# EAGLE design M611B (EAGLE 6.6.0)
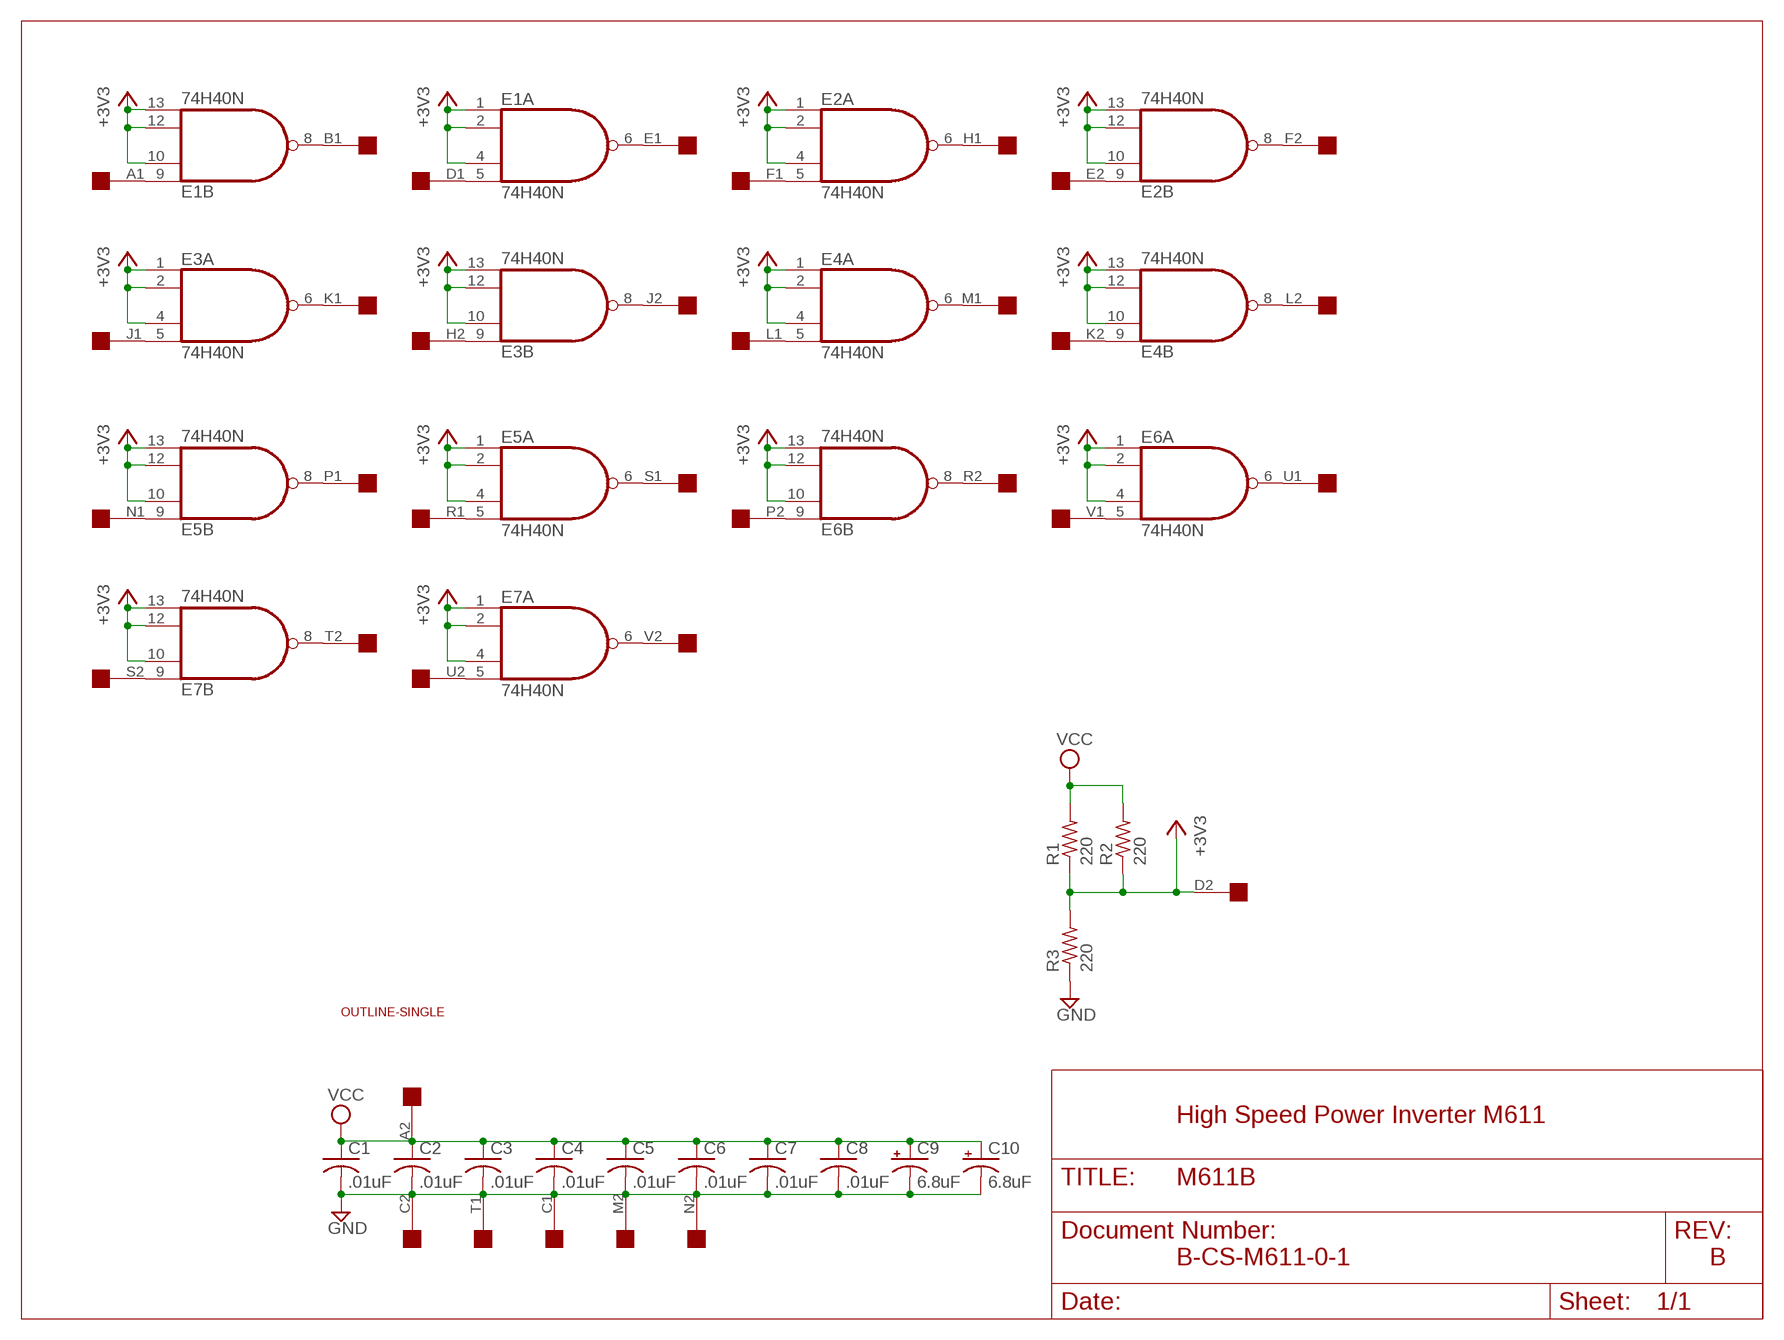
[diagram p0: schematic, sheet 1]

## Parts
C1  .01uF  C-US050-025X075  [C050-025X075]
C2  .01uF  C-US050-025X075  [C050-025X075]
C3  .01uF  C-US050-025X075  [C050-025X075]
C4  .01uF  C-US050-025X075  [C050-025X075]
C5  .01uF  C-US050-025X075  [C050-025X075]
C6  .01uF  C-US050-025X075  [C050-025X075]
C7  .01uF  C-US050-025X075  [C050-025X075]
C8  .01uF  C-US050-025X075  [C050-025X075]
C9  6.8uF  CPOL-USE20-8AXIAL  [E12-8]
C10  6.8uF  CPOL-USE20-8AXIAL  [E12-8]
E1  74H40N  74S20N  [DIL14]
E2  74H40N  74S20N  [DIL14]
E3  74H40N  74S20N  [DIL14]
E4  74H40N  74S20N  [DIL14]
E5  74H40N  74S20N  [DIL14]
E6  74H40N  74S20N  [DIL14]
E7  74H40N  74S20N  [DIL14]
R1  220  R-US_0207/10  [0207/10]
R2  220  R-US_0207/10  [0207/10]
R3  220  R-US_0207/10  [0207/10]
U$1  SINGLE  [EDGE-CON2]
U$4  OUTLINE-SINGLE  [SINGLE]

## Nets
+3V3 [Supply]: E1.1(A:I0) E1.2(A:I1) E1.4(A:I2) E1.10(B:I1) E1.12(B:I2) E1.13(B:I3) E2.1(A:I0) E2.2(A:I1) E2.4(A:I2) E2.10(B:I1) E2.12(B:I2) E2.13(B:I3) E3.1(A:I0) E3.2(A:I1) E3.4(A:I2) E3.10(B:I1) E3.12(B:I2) E3.13(B:I3) E4.1(A:I0) E4.2(A:I1) E4.4(A:I2) E4.10(B:I1) E4.12(B:I2) E4.13(B:I3) E5.1(A:I0) E5.2(A:I1) E5.4(A:I2) E5.10(B:I1) E5.12(B:I2) E5.13(B:I3) E6.1(A:I0) E6.2(A:I1) E6.4(A:I2) E6.10(B:I1) E6.12(B:I2) E6.13(B:I3) E7.1(A:I0) E7.2(A:I1) E7.4(A:I2) E7.10(B:I1) E7.12(B:I2) E7.13(B:I3) R1.1 R2.1 R3.2 U$1.D2
GND [Supply]: C1.2 C2.2 C3.2 C4.2 C5.2 C6.2 C7.2 C8.2 C9.- C10.- R3.1 U$1.C1 U$1.C2 U$1.M2 U$1.N2 U$1.T1
N$1: E1.9(B:I0) U$1.A1
N$2: E1.8(B:O) U$1.B1
N$3: E1.5(A:I3) U$1.D1
N$4: E1.6(A:O) U$1.E1
N$5: E2.6(A:O) U$1.H1
N$6: E2.5(A:I3) U$1.F1
N$7: E3.5(A:I3) U$1.J1
N$8: E3.6(A:O) U$1.K1
N$9: E2.9(B:I0) U$1.E2
N$10: E2.8(B:O) U$1.F2
N$11: E3.9(B:I0) U$1.H2
N$12: E3.8(B:O) U$1.J2
N$13: E4.5(A:I3) U$1.L1
N$14: E4.6(A:O) U$1.M1
N$15: E4.9(B:I0) U$1.K2
N$16: E4.8(B:O) U$1.L2
N$17: E5.9(B:I0) U$1.N1
N$18: E5.8(B:O) U$1.P1
N$19: E5.5(A:I3) U$1.R1
N$20: E5.6(A:O) U$1.S1
N$21: E6.9(B:I0) U$1.P2
N$22: E6.8(B:O) U$1.R2
N$23: E6.5(A:I3) U$1.V1
N$24: E6.6(A:O) U$1.U1
N$25: E7.9(B:I0) U$1.S2
N$26: E7.8(B:O) U$1.T2
N$27: E7.5(A:I3) U$1.U2
N$28: E7.6(A:O) U$1.V2
VCC [Supply]: C1.1 C2.1 C3.1 C4.1 C5.1 C6.1 C7.1 C8.1 C9.+ C10.+ R1.2 R2.2 U$1.A2
Unconnected: U$1.B2

## Notes on the sheet
- High Speed Power Inverter M611
- B-CS-M611-0-1 | B

## Power pins joined to a net without a drawn wire
GND: E1.7(P:GND) E2.7(P:GND) E3.7(P:GND) E4.7(P:GND) E5.7(P:GND) E6.7(P:GND) E7.7(P:GND)
VCC: E1.14(P:VCC) E2.14(P:VCC) E3.14(P:VCC) E4.14(P:VCC) E5.14(P:VCC) E6.14(P:VCC) E7.14(P:VCC)

## Library data of the parts
C1-C8 = rcl:C-US: CAPACITOR, American symbol
C9 C10 = dec-con:CPOL-USE20-8AXIAL: A 0.8 inch electrolytic.
E1-E7 = 74xx-us:74*20: Dual 4-input NAND gate
R1-R3 = rcl:R-US_: RESISTOR, American symbol
U$1 = dec-con:SINGLE: Single-Height DEC board
U$4 = dec-con:OUTLINE-*: Board outlines for DEC boards.

## Net classes
1 Supply: width 0.813 mm

## Board
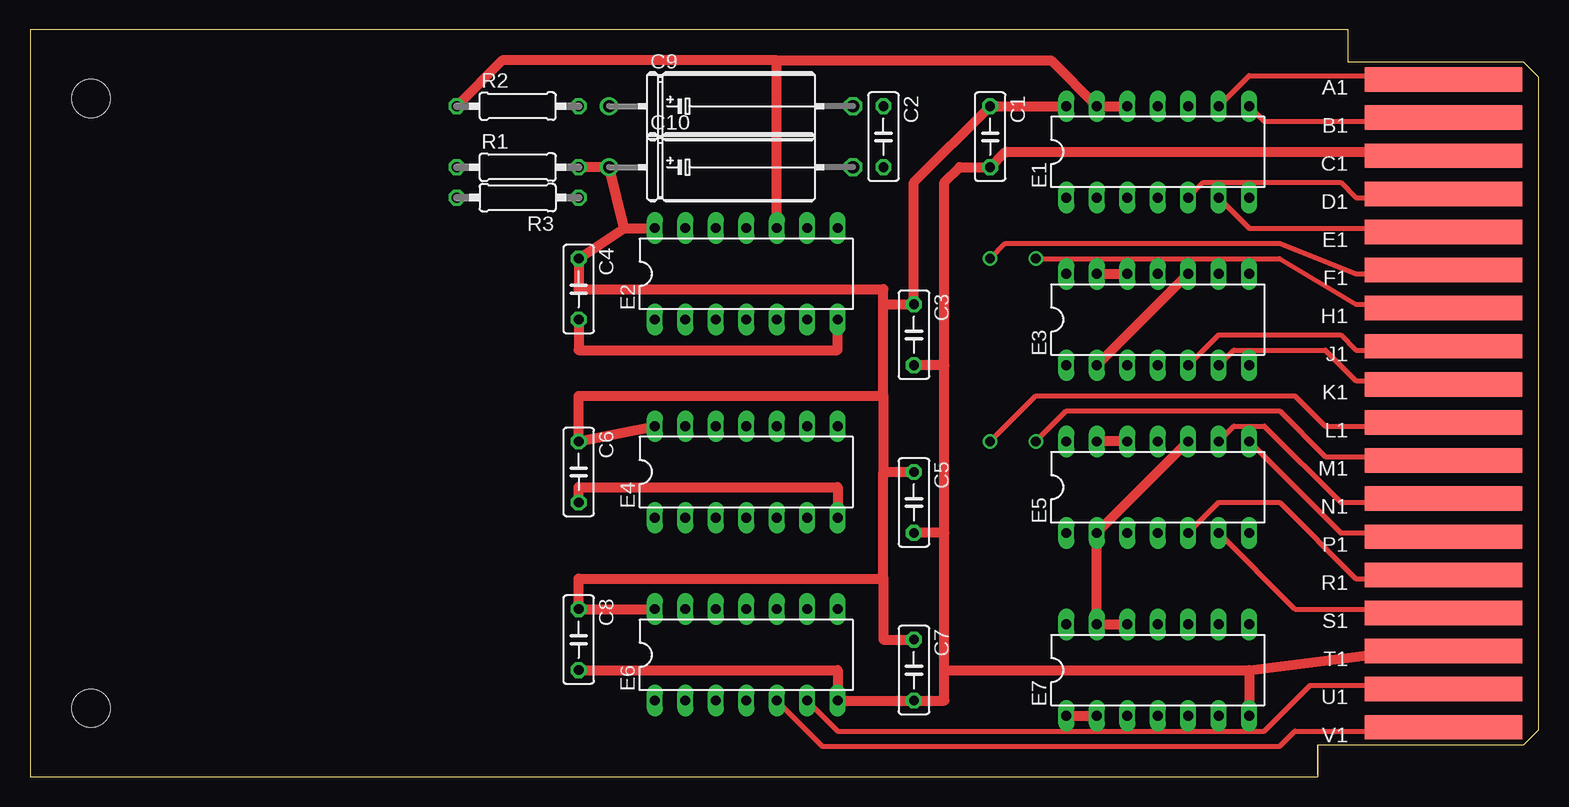
[diagram p1: board, top side]
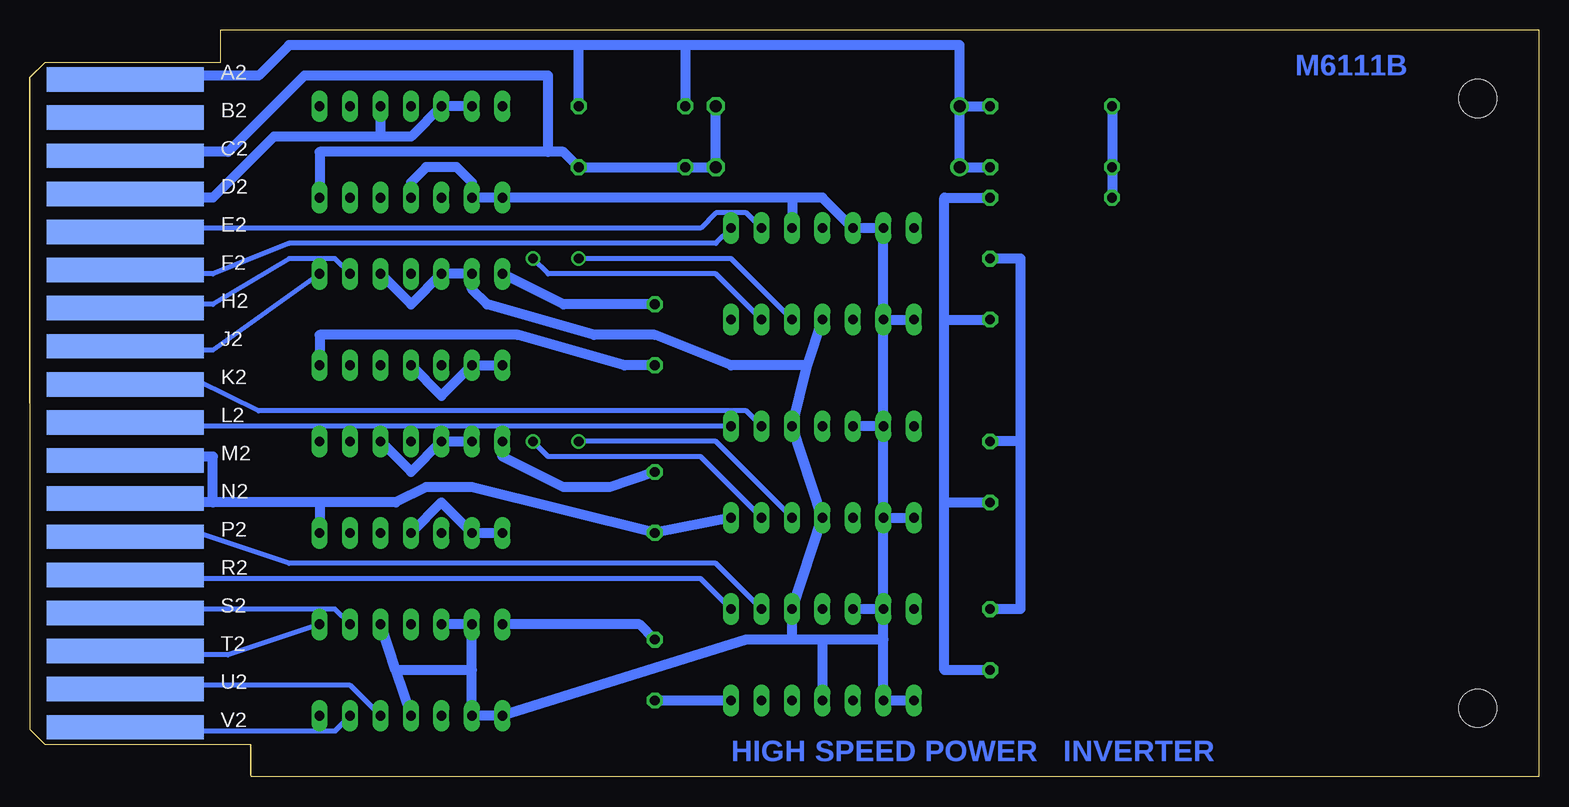
[diagram p2: board, bottom side, seen from below]

Size 125.73 x 62.23 mm. Coordinates in mm from the lower left corner, seen from the top.
Copper layers (1+16): Top 0.035mm / dielectric 1.5mm / Bottom 0.035mm
Design rules "16mils": minimum track width 16mil, minimum drill 32mil, track to track 15mil, track to pad 10mil, pad to pad 10mil, via to via 10mil, smd to smd 10mil, copper to edge 13mil, drill to drill 10mil, minimum pad ring 10mil, minimum via ring 8mil, stop-mask expansion 0mil, vias tented up to drill 0mil, thermal gap 10mil

### Footprints (pad centres in the part's own frame; a part is rotated, then mirrored left to right if it is on the bottom)
C050-025X075 = drill 0.813 octagon: 1 -2.54,0; 2 2.54,0
E12-8 = drill 1.016: + -10.16,0 | drill 1.016 octagon: - 10.16,0
DIL14 = drill 0.813 long: 1 -7.62,-3.81; 2 -5.08,-3.81; 3 -2.54,-3.81; 4 0,-3.81; 5 2.54,-3.81; 6 5.08,-3.81; 7 7.62,-3.81; 8 7.62,3.81; 9 5.08,3.81; 10 2.54,3.81; 11 0,3.81; 12 -2.54,3.81; 13 -5.08,3.81; 14 -7.62,3.81
0207/10 = drill 0.813 octagon: 1 -5.08,0; 2 5.08,0
EDGE-CON2 = smd 13.106 x 2.032: A1 7.938,4.128; B1 7.938,7.303; C1 7.938,10.477; D1 7.938,13.652; E1 7.938,16.828; F1 7.938,20.003; H1 7.938,23.177; J1 7.938,26.352; K1 7.938,29.527; L1 7.938,32.703; M1 7.938,35.877; N1 7.938,39.053; P1 7.938,42.227; R1 7.938,45.403; S1 7.938,48.578; T1 7.938,51.752; U1 7.938,54.928; V1 7.938,58.102 | smd 13.106 x 2.032 bottom: A2 7.938,4.128; B2 7.938,7.303; C2 7.938,10.477; D2 7.938,13.652; E2 7.938,16.828; F2 7.938,20.003; H2 7.938,23.177; J2 7.938,26.352; K2 7.938,29.527; L2 7.938,32.703; M2 7.938,35.877; N2 7.938,39.053; P2 7.938,42.227; R2 7.938,45.403; S2 7.938,48.578; T2 7.938,51.752; U2 7.938,54.928; V2 7.938,58.102
SINGLE = hole 3.175: 120.65,56.515; 120.65,5.715

### Placement (x,y rotation side)
C1  80.01,53.34 270 top
C2  71.12,53.34 270 top
C3  73.66,36.83 270 top
C4  45.72,40.64 270 top
C5  73.66,22.86 270 top
C6  45.72,25.4 270 top
C7  73.66,8.89 270 top
C8  45.72,11.43 270 top
C9  58.42,55.88 0 top
C10  58.42,50.8 0 top
E1  93.98,52.07 0 top
E2  59.69,41.91 0 top
E3  93.98,38.1 0 top
E4  59.69,25.4 0 top
E5  93.98,24.13 0 top
E6  59.69,10.16 0 top
E7  93.98,8.89 0 top
R1  40.64,50.8 0 top
R2  40.64,55.88 0 top
R3  40.64,48.26 180 top
U$1  125.73,62.23 180 top
U$4  125.73,62.23 180 top

### Tracks (layer width: path | path; a pad name or v marks a point on that pad's centre or on a via)
+3V3
  Top 0.813: E1.12 E1.13 85.09,59.69 62.23,59.69 | 62.23,59.69 39.37,59.69 R2.1 | E2.10 62.23,59.69 | E3.13 E3.12 | E5.12 E5.13 | E7.12 E7.13 E5.2 E5.10 | E7.1 E7.2 | E3.10 E3.2
  Bottom 0.813: E5.13 E5.12 93.98,25.4 E5.10 | E7.12 E7.13 88.9,8.89 | 54.61,11.43 59.69,11.43 | 59.69,11.43 62.23,11.43 | 62.23,48.26 59.69,48.26 E2.12 E2.13 E2.2 | R2.1 R1.1 R3.2 | E1.4 93.98,49.53 92.71,50.8 90.17,50.8 88.9,49.53 E1.2 E1.1 62.23,48.26 | E1.13 E1.12 93.98,53.34 96.52,53.34 | U$1.D2 117.14,48.56 116.84,48.26 110.49,48.26 105.41,53.34 96.52,53.34 | 96.52,53.34 E1.10 | 62.23,48.26 E2.10 | E2.2 E2.1 | E5.1 E5.2 91.44,22.86 E5.4 | E6.1 E6.2 54.61,11.43 | 54.61,11.43 E6.13 | E4.2 E4.1 | E6.13 E4.2 | E6.13 E6.12 | E4.13 E4.12 | E4.2 E4.13 | E4.13 E2.2 | 59.69,11.43 E6.4 | 62.23,11.43 E6.10 E4.4 E4.10 60.96,34.29 | 60.96,34.29 E2.4 | 62.23,11.43 66.04,11.43 E7.1 E7.2 88.9,8.89 | 95.25,8.89 E7.4 | 95.25,8.89 E7.10 | 88.9,8.89 95.25,8.89 | E3.1 E3.2 91.44,31.75 E3.4 | E3.10 93.98,39.37 E3.12 E3.13 88.9,40.64 87.63,39.37 78.74,36.83 73.66,36.83 67.31,34.29 60.96,34.29
GND
  Top 0.813: 116.84,52.07 U$1.C1 117.17,51.74 116.84,52.07 | 116.84,52.07 81.28,52.07 C1.2 77.47,50.8 76.2,49.53 76.2,34.29 | C4.2 45.72,35.56 67.31,35.56 E2.7 | 76.2,8.89 76.2,6.35 C7.2 E6.7 67.31,8.89 C8.2 | 76.2,8.89 76.2,20.32 | 76.2,20.32 C5.2 | 76.2,34.29 C3.2 | 76.2,20.32 76.2,34.29 | C6.2 45.72,24.13 67.31,24.13 E4.7 | 101.6,8.89 111.76,10.16 U$1.T1 | 101.6,8.89 E7.7 | 76.2,8.89 101.6,8.89
  Bottom 0.813: R3.1 49.53,48.26 49.53,38.1 | 49.53,38.1 C4.2 | C8.2 49.53,8.89 49.53,22.86 | 49.53,22.86 49.53,38.1 | 49.53,22.86 C6.2 | C9.- C10.- C2.2 C1.2 81.28,52.07 82.55,52.07 | 82.55,52.07 101.6,52.07 E1.7 | U$1.C1 115.9,51.74 115.57,52.07 109.22,52.07 102.87,58.42 82.55,58.42 82.55,52.07 | E6.7 C7.2 | E4.7 C5.2 88.9,24.13 92.71,24.13 95.25,22.86 101.6,22.86 | U$1.N2 116.84,22.86 110.49,22.86 | 101.6,22.86 110.49,22.86 | U$1.M2 116.84,26.67 110.49,26.67 110.49,22.86 | 101.6,22.86 E5.7 | E3.7 101.6,36.83 85.09,36.83 76.2,34.29 C3.2
N$1
  Top 0.406: U$1.A1 117.24,58.02 116.84,58.42 101.6,58.42 E1.9
N$2
  Top 0.406: U$1.B1 117.13,54.9 116.84,54.61 102.87,54.61 E1.8
N$3
  Top 0.406: U$1.D1 116.84,48.26 110.49,48.26 109.22,49.53 97.79,49.53 E1.5
N$4
  Top 0.406: U$1.E1 116.84,45.72 101.6,45.72 E1.6
N$5  (via drill 0.81)
  Top 0.406: v83.82,43.18 104.14,43.18 110.49,39.37 116.84,39.37 U$1.H1
  Bottom 0.406: E2.6 68.58,41.91 82.55,41.91 v83.82,43.18
N$6  (via drill 0.81)
  Top 0.406: v80.01,43.18 81.28,44.45 104.14,44.45 110.49,41.91 116.84,41.91 U$1.F1
  Bottom 0.406: E2.5 67.31,43.18 v80.01,43.18
N$7
  Top 0.406: E3.5 99.06,36.83 109.22,36.83 110.49,35.56 116.84,35.56 U$1.J1
N$8
  Top 0.406: U$1.K1 116.84,33.02 110.49,33.02 107.95,35.56 100.33,35.56 E3.6
N$9
  Bottom 0.406: E2.9 66.04,46.99 68.58,46.99 69.85,45.72 116.84,45.72 U$1.E2
N$10
  Bottom 0.406: E2.8 68.58,44.45 104.14,44.45 110.49,41.91 116.84,41.91 U$1.F2
N$11
  Bottom 0.406: U$1.H2 116.84,39.37 110.49,39.37 104.14,43.18 100.33,43.18 E3.9
N$12
  Bottom 0.406: U$1.J2 116.84,35.56 110.49,35.56 E3.8
N$13  (via drill 0.81)
  Top 0.406: v80.01,27.94 83.82,31.75 105.41,31.75 107.95,29.21 116.84,29.21 U$1.L1
  Bottom 0.406: E4.5 68.58,27.94 v80.01,27.94
N$14  (via drill 0.81)
  Top 0.406: U$1.M1 116.84,26.67 107.95,26.67 104.14,30.48 86.36,30.48 v83.82,27.94
  Bottom 0.406: E4.6 69.85,26.67 82.55,26.67 v83.82,27.94
N$15
  Bottom 0.406: U$1.K2 116.84,33.02 111.76,33.02 106.68,30.48 66.04,30.48 E4.9
N$16
  Bottom 0.406: U$1.L2 116.84,29.21 E4.8
N$17
  Top 0.406: E5.9 100.33,29.21 102.87,29.21 109.22,22.86 116.84,22.86 U$1.N1
N$18
  Top 0.406: U$1.P1 116.84,20.32 109.22,20.32 E5.8
N$19
  Top 0.406: E5.5 99.06,22.86 104.14,22.86 110.49,16.51 116.84,16.51 U$1.R1
N$20
  Top 0.406: U$1.S1 116.84,13.97 105.41,13.97 E5.6
N$21
  Bottom 0.406: E6.9 68.58,17.78 104.14,17.78 111.76,20.32 116.84,20.32 U$1.P2
N$22
  Bottom 0.406: U$1.R2 116.84,16.51 69.85,16.51 E6.8
N$23
  Top 0.406: E6.5 66.04,2.54 104.14,2.54 105.41,3.81 116.84,3.81 U$1.V1
N$24
  Top 0.406: E6.6 67.31,3.81 102.87,3.81 106.68,7.62 116.84,7.62 U$1.U1
N$25
  Bottom 0.406: U$1.S2 116.84,13.97 100.33,13.97 E7.9
N$26
  Bottom 0.406: U$1.T2 116.84,10.16 109.22,10.16 E7.8
N$27
  Bottom 0.406: U$1.U2 116.84,7.62 99.06,7.62 E7.5
N$28
  Bottom 0.406: U$1.V2 116.84,3.81 100.33,3.81 E7.6
VCC
  Top 0.813: E1.14 C1.1 73.66,49.53 C3.1 71.12,39.37 | 49.53,45.72 C4.1 45.72,40.64 71.12,40.64 71.12,39.37 | 49.53,45.72 E2.14 | R1.2 C10.+ 49.53,45.72 | E6.14 C8.1 45.72,16.51 71.12,16.51 | E4.14 C6.1 45.72,31.75 71.12,31.75 | C7.1 71.12,11.43 71.12,16.51 | 71.12,16.51 71.12,25.4 | 71.12,25.4 C5.1 | 71.12,31.75 71.12,25.4 | 71.12,31.75 71.12,39.37
  Bottom 0.813: U$1.A2 116.84,58.42 106.68,58.42 104.14,60.96 80.01,60.96 | C1.1 80.01,60.96 | 71.12,60.96 C2.1 | 71.12,60.96 80.01,60.96 | C9.+ C10.+ R1.2 | C9.+ 48.26,60.96 71.12,60.96 | C9.+ R2.2 | C8.1 43.18,13.97 43.18,27.94 | 43.18,27.94 43.18,43.18 C4.1 | 43.18,27.94 C6.1 | E7.14 74.93,12.7 C7.1 | C5.1 77.47,24.13 81.28,24.13 86.36,26.67 E5.14 | C3.1 81.28,39.37 E3.14

### Text on the board
Bottom: M6111B | HIGH SPEED POWER INVERTER